# EAGLE design Nano (EAGLE 8.5.1)
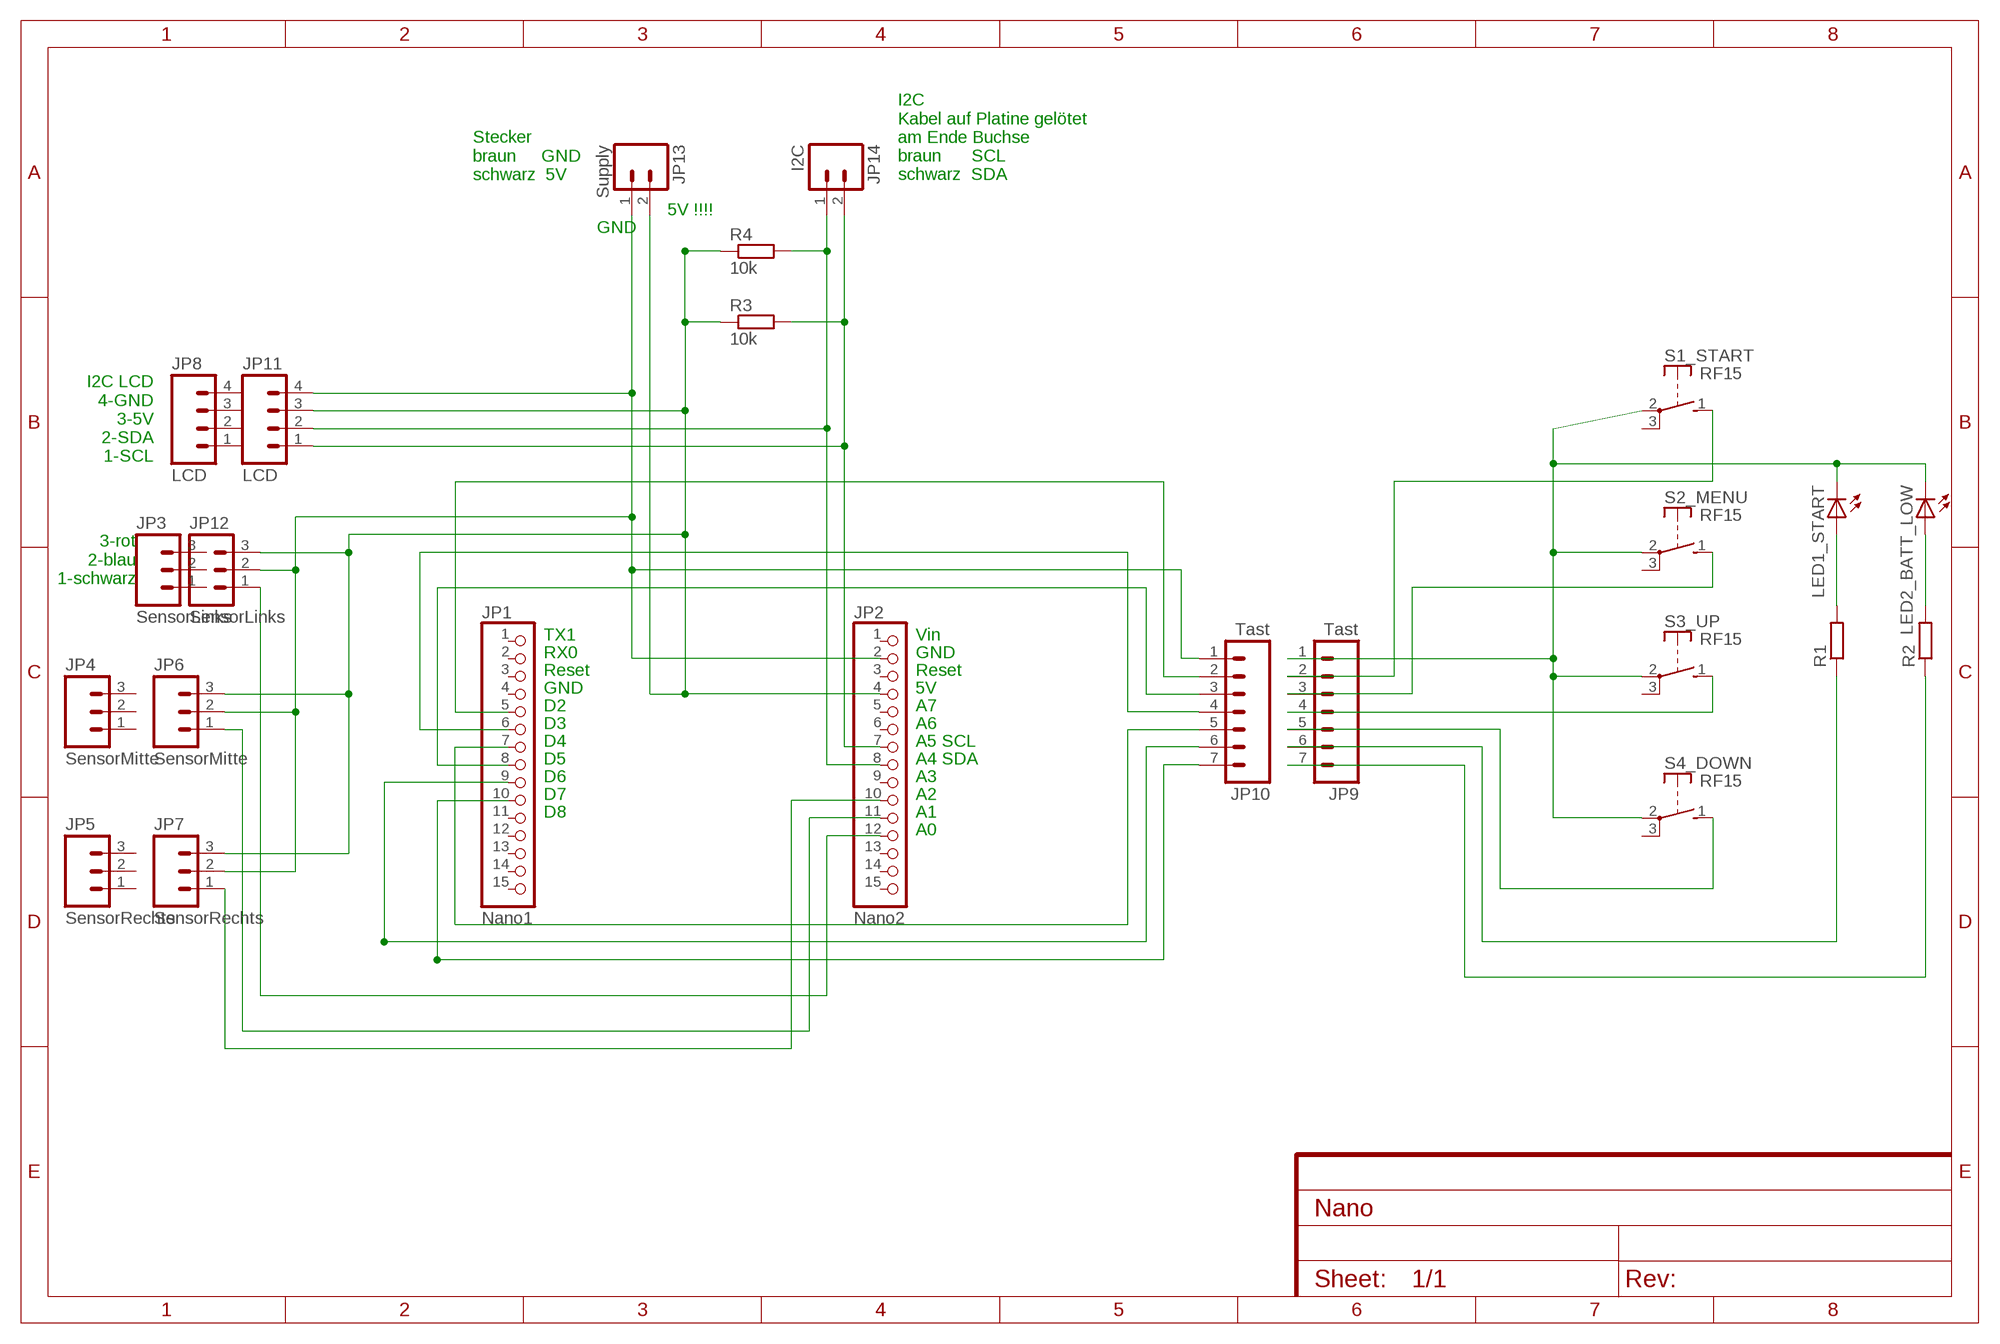
[diagram p0: schematic, sheet 1]

## Parts
JP1  Nano1  PINHD-1X15  [1X15]
JP2  Nano2  PINHD-1X15  [1X15]
JP3  SensorLinks  M03LOCK  [1X03_LOCK]
JP4  SensorMitte  M03LOCK  [1X03_LOCK]
JP5  SensorRechts  M03LOCK  [1X03_LOCK]
JP6  SensorMitte  M03LOCK  [1X03_LOCK]
JP7  SensorRechts  M03LOCK  [1X03_LOCK]
JP8  LCD  M04LOCK  [1X04_LOCK]
JP9  Tast  M07  [1X07]
JP10  Tast  M07  [1X07]
JP11  LCD  M04LOCK  [1X04_LOCK]
JP12  SensorLinks  M03LOCK  [1X03_LOCK]
JP13  Supply  M02LOCK  [1X02_LOCK]
JP14  I2C  M02LOCK  [1X02_LOCK]
LED1_START  LED_ELD260  [LED_LD260]
LED2_BATT_LOW  LED_ELD260  [LED_LD260]
R1  R-EU_0204/5  [0204/5]
R2  R-EU_0204/5  [0204/5]
R3  10k  R-EU_0204/5  [0204/5]
R4  10k  R-EU_0204/5  [0204/5]
S1_START  RF15  [RF15]
S2_MENU  RF15  [RF15]
S3_UP  RF15  [RF15]
S4_DOWN  RF15  [RF15]

## Nets
GND: JP9.1 LED1_START.K(C) LED2_BATT_LOW.K(C) S1_START.2(P) S2_MENU.2(P) S3_UP.2(P) S4_DOWN.2(P)
N$1: JP1.5 JP10.2
N$2: JP1.8 JP10.3
N$3: JP1.6 JP10.4
N$4: JP1.7 JP10.5
N$5: JP9.7 R2.1
N$7: LED2_BATT_LOW.A R2.2
N$8: LED1_START.A R1.2
N$9: JP1.9 JP10.6
N$11: JP2.12 JP12.1
N$12: JP2.11 JP6.1
N$13: JP2.10 JP7.1
N$21: JP2.4 JP6.3 JP7.3 JP11.3 JP12.3 JP13.2 R3.1 R4.1
N$22: JP2.2 JP6.2 JP7.2 JP10.1 JP11.4 JP12.2 JP13.1
N$23: JP2.7 JP11.1 JP14.2 R3.2
N$24: JP2.8 JP11.2 JP14.1 R4.2
N$26: JP9.2 S1_START.1(S)
N$27: JP9.4 S3_UP.1(S)
N$28: JP9.3 S2_MENU.1(S)
N$29: JP9.5 S4_DOWN.1(S)
N$30: JP9.6 R1.1
N$32: JP1.10 JP10.7
Unconnected: JP1.1 JP1.2 JP1.3 JP1.4 JP1.11 JP1.12 JP1.13 JP1.14 JP1.15 JP2.1 JP2.3 JP2.5 JP2.6 JP2.9 JP2.13 JP2.14 JP2.15 JP3.1 JP3.2 JP3.3 JP4.1 JP4.2 JP4.3 JP5.1 JP5.2 JP5.3 JP8.1 JP8.2 JP8.3 JP8.4 S1_START.3(P) S2_MENU.3(P) S3_UP.3(P) S4_DOWN.3(P)

## Notes on the sheet
- Stecker
  braun     GND
  schwarz  5V
- I2C
  Kabel auf Platine gelötet
  am Ende Buchse
  braun      SCL
  schwarz  SDA
- 5V !!!!
- GND
- I2C LCD
  4-GND
  3-5V
  2-SDA
  1-SCL
- 3-rot
  2-blau
  1-schwarz
- TX1 | Vin
- RX0 | GND
- Reset | Reset
- GND | 5V
- D2 | A7
- D3 | A6
- D4 | A5 SCL
- D5 | A4 SDA
- D6 | A3
- D7 | A2
- D8 | A1
- A0

## Library data of the parts
JP1 JP2 = adafruit:PINHD-1X15: PIN HEADER
JP3-JP7 JP12 = SparkFun-Connectors:M03: Header 3 Standard 3-pin 0.1" header. Use with straight break away headers (SKU : PRT-00116), right angle break away headers (PRT-00553), swiss pins (PRT-00743), machine pins (PRT-00117), and female headers (PRT-00115). Molex polarized connector foot print use with SKU : PRT-08232 with associated crimp pins and housings.
JP8 JP11 = SparkFun-Connectors:M04: Header 4 Standard 4-pin 0.1" header. Use with straight break away headers (SKU : PRT-00116), right angle break away headers (PRT-00553), swiss pins (PRT-00743), machine pins (PRT-00117), and female headers (PRT-00115). Molex polarized connector foot print use with SKU : PRT-08231 with associated crimp pins and housings. 1MM SMD Version SKU: PRT-10208
JP9 JP10 = SparkFun-Connectors:M07: Header 7 Standard 7-pin 0.1" header. Use with straight break away headers (SKU : PRT-00116), right angle break away headers (PRT-00553), swiss pins (PRT-00743), machine pins (PRT-00117), and female headers (PRT-00115). NOTES ON THE VARIANTS LOCK and LOCK_LONGPADS... This footprint was designed to help hold the alignment of a through-hole component (i.e. 7-pin header) while soldering it into place. You may notice that each hole has been shifted either up or down by 0.005 of an inch from it's more standard position (which is usually a perfectly straight line). This slight alteration caused the pins (the squares in the middle) to touch the edges of the holes. Because they are alternating, it causes a "brace" to hold the header in place. 0.005 has proven to be the perfect amount of "off-center" position when using our standard breakaway headers. Although looks a little odd when you look at the bare footprint, once you have a header in there, the alteration is very hard to notice. Also, if you push a header all the way into place, it is covered up entirely on the bottom side. This idea of altering the position of holes to aid alignment will be further integrated into the Sparkfun Library for other footprints. It can help hold any component with 3 or more connection pins.
JP13 JP14 = SparkFun-Connectors:M02: Standard 2-pin 0.1" header. Use with - straight break away headers ( PRT-00116) - right angle break away headers (PRT-00553) - swiss pins (PRT-00743) - machine pins (PRT-00117) - female headers (PRT-00115) Molex polarized connector foot print use with: PRT-08233 with associated crimp pins and housings. 2.54_SCREWTERM for use with PRT-10571. 3.5mm Screw Terminal footprints for PRT-08084 5mm Screw Terminal footprints for use with PRT-08432
LED1_START LED2_BATT_LOW = eagle-ltspice:LED_E: LED Source: http://www.osram.convergy.de Source: www.luxeon.com Source: www.kingbright.com; SPICEMODEL: NONE; SPICEPREFIX: D; SPICETYPE: diode
R1-R4 = rcl:R-EU_: RESISTOR, European symbol
S1_START S2_MENU S3_UP S4_DOWN = switch-misc:RF15: RAFI SWITCH

## Board
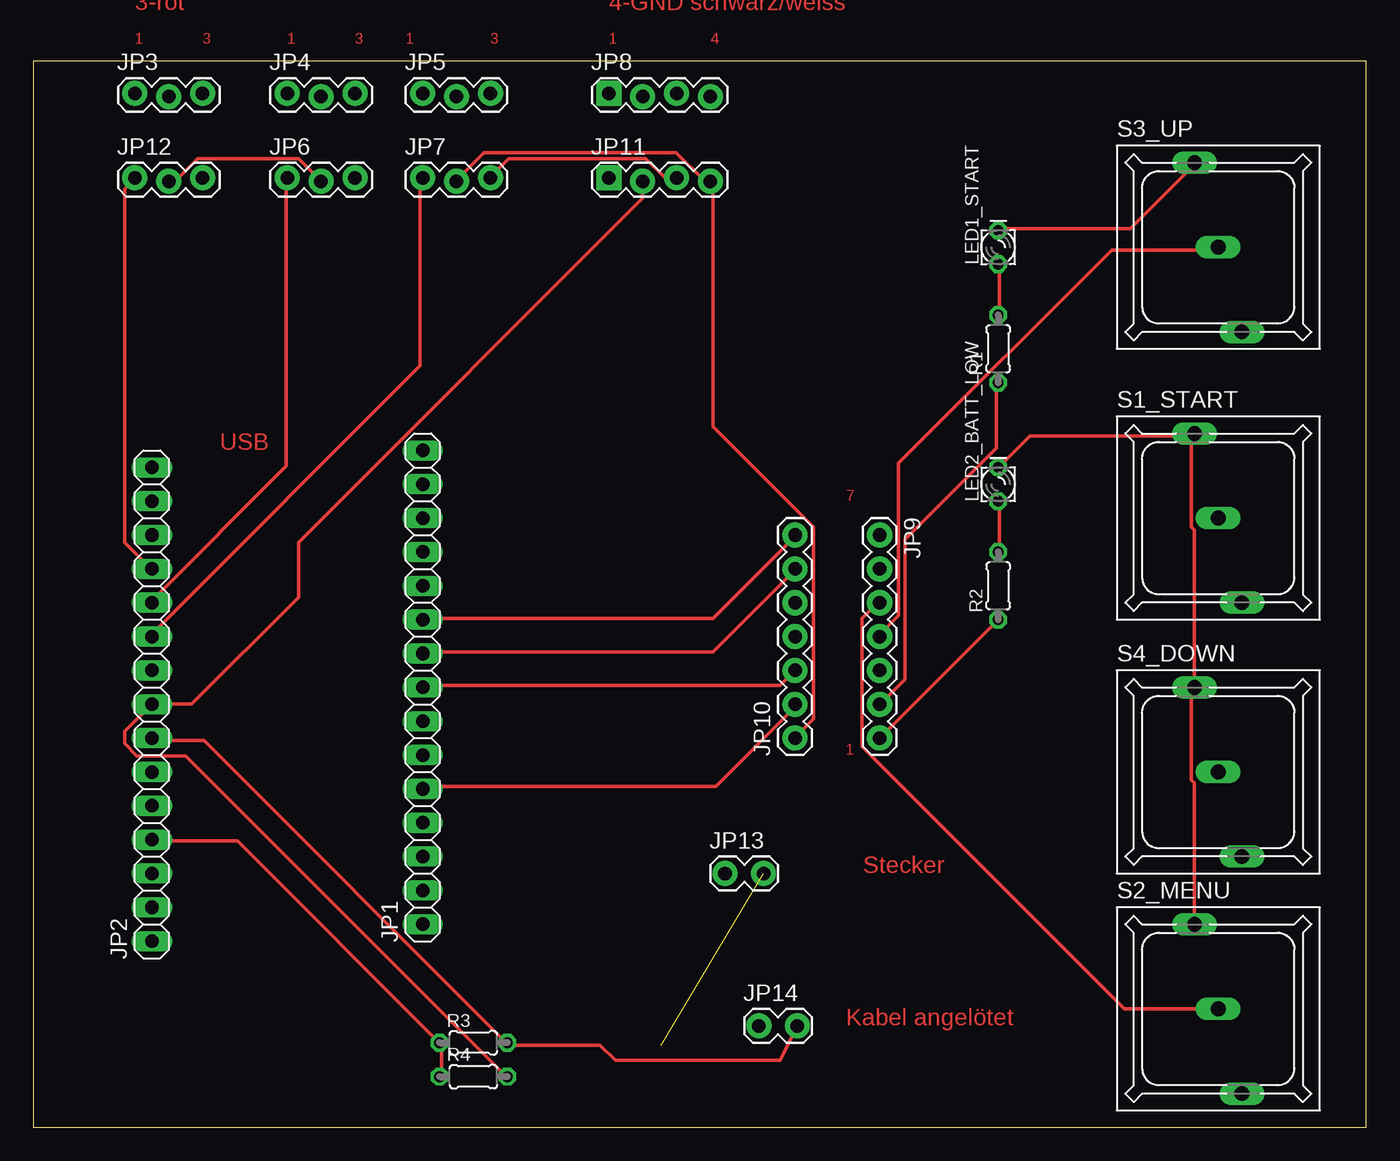
[diagram p1: board, top side]
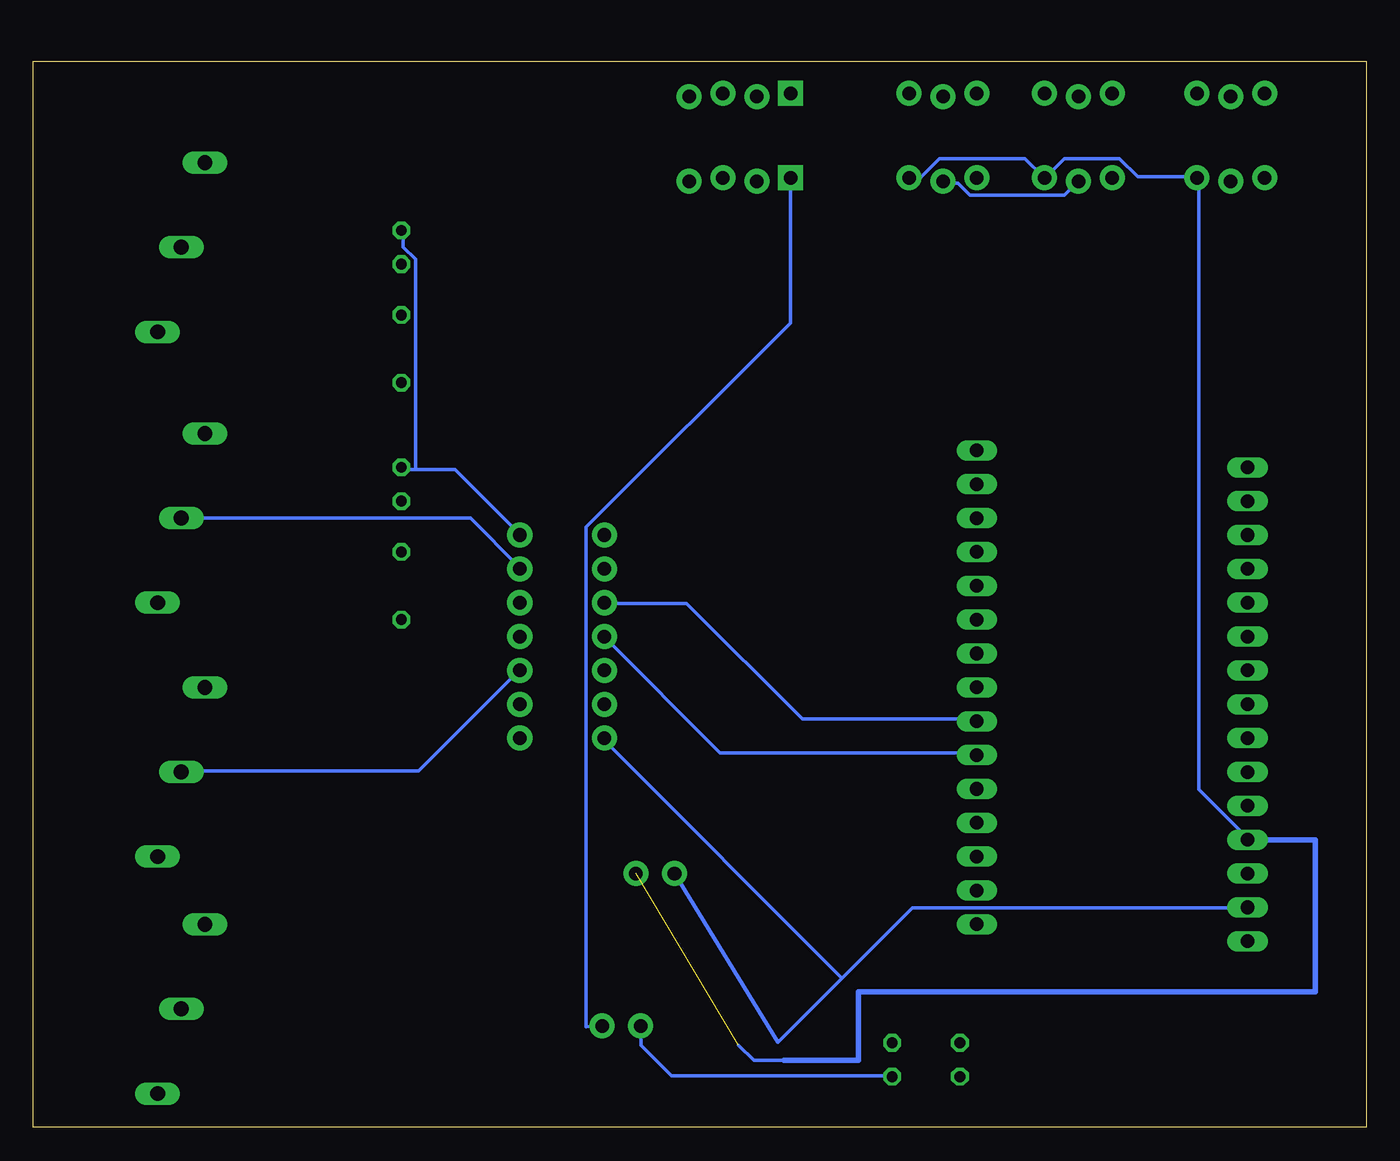
[diagram p2: board, bottom side, seen from below]

Size 100 x 80 mm. Coordinates in mm from the lower left corner, seen from the top.
Outline: 0,0 100,0 100,80 0,80 0,0
Copper layers (1*16): Top 0.035mm / dielectric 1.5mm / Bottom 0.035mm
Design rules "default": minimum track width 10mil, minimum drill 24mil, track to track 8mil, track to pad 8mil, pad to pad 8mil, via to via 8mil, smd to smd 8mil, copper to edge 40mil, drill to drill 8mil, minimum pad ring 10mil, minimum via ring 8mil, stop-mask expansion 4mil, vias tented up to drill 0mil, thermal gap 10mil

### Footprints (pad centres in the part's own frame; a part is rotated, then mirrored left to right if it is on the bottom)
1X15 = drill 1.016 long: 1 -17.78,0; 2 -15.24,0; 3 -12.7,0; 4 -10.16,0; 5 -7.62,0; 6 -5.08,0; 7 -2.54,0; 8 0,0; 9 2.54,0; 10 5.08,0; 11 7.62,0; 12 10.16,0; 13 12.7,0; 14 15.24,0; 15 17.78,0
1X03_LOCK = drill 1.016 pad 1.88: 1 0,0.127; 2 2.54,-0.127; 3 5.08,0.127
1X04_LOCK = drill 1.016 pad 1.88 square: 1 0,0.127 | drill 1.016 pad 1.88: 2 2.54,-0.127; 3 5.08,0.127; 4 7.62,-0.127
1X07 = drill 1.016 pad 1.88: 1 0,0; 2 2.54,0; 3 5.08,0; 4 7.62,0; 5 10.16,0; 6 12.7,0; 7 15.24,0
1X02_LOCK = drill 1.016 pad 1.88: 1 -0.178,0; 2 2.718,0
LED_LD260 = drill 0.813 octagon: A -1.27,0; K 1.27,0
0204/5 = drill 0.813 octagon: 1 -2.54,0; 2 2.54,0
RF15 = drill 1.118 long: 1 0,0; 2 -1.778,6.35; 3 1.778,-6.35

### Placement (x,y rotation side)
JP1  29.21,33.02 90 top
JP2  8.89,31.75 90 top
JP3  7.62,77.47 0 top
JP4  19.05,77.47 0 top
JP5  29.21,77.47 0 top
JP6  19.05,71.12 0 top
JP7  29.21,71.12 0 top
JP8  43.18,77.47 0 top
JP9  63.5,44.45 270 top
JP10  57.15,29.21 90 top
JP11  43.18,71.12 0 top
JP12  7.62,71.12 0 top
JP13  52.07,19.05 0 top
JP14  54.61,7.62 0 top
LED1_START  72.39,66.04 90 top
LED2_BATT_LOW  72.39,48.26 90 top
R1  72.39,58.42 90 top
R2  72.39,40.64 90 top
R3  33.02,6.35 0 top
R4  33.02,3.81 0 top
S1_START  88.9,45.72 0 top
S2_MENU  88.9,8.89 0 top
S3_UP  88.9,66.04 0 top
S4_DOWN  88.9,26.67 0 top

### Tracks (layer width: path | path; a pad name or v marks a point on that pad's centre or on a via)
GND
  Top 0.254: LED1_START.K 72.47,67.44 82.3,67.44 87.1,72.24 S3_UP.2 | S2_MENU.2 87.1,15.32 87.1,25.83 86.87,26.06 86.87,32.69 87.1,32.92 S4_DOWN.2 87.1,33.15 87.1,44.81 86.87,45.03 86.87,51.89 | 86.87,51.89 74.75,51.89 LED2_BATT_LOW.K | 86.87,51.89 87.1,51.89 S1_START.2 86.87,51.89
  Bottom 0.254: 71.32,49.38 68.35,49.38 63.55,44.58 JP9.1 | 71.32,49.38 72.24,49.38 LED2_BATT_LOW.K | 71.32,49.38 71.32,65.15 72.24,66.06 72.24,67.21 LED1_START.K
N$1
  Top 0.254: JP1.5 29.26,25.6 51.21,25.6 57.15,31.55 JP10.2
N$2
  Top 0.254: JP10.3 56.01,33.15 29.26,33.15 JP1.8
N$3
  Bottom 0.254: JP1.6 29.26,28.12 48.46,28.12 57.15,36.8 JP10.4
N$4
  Bottom 0.254: JP1.7 29.26,30.63 42.29,30.63 50.98,39.32 57.15,39.32 JP10.5
N$5
  Top 0.254: JP9.7 R2.1
N$7
  Top 0.254: R2.2 72.47,43.2 72.47,46.86 LED2_BATT_LOW.A
N$8
  Top 0.254: R1.2 72.47,61.04 72.47,64.69 LED1_START.A
N$9
  Top 0.254: JP1.9 29.26,35.66 50.98,35.66 57.15,41.83 JP10.6
N$11
  Top 0.254: JP2.12 8.69,42.06 6.86,43.89 6.86,70.41 7.54,71.09 JP12.1
N$12
  Top 0.254: JP2.11 8.91,39.55 18.97,49.61 18.97,71.09 JP6.1
N$13
  Top 0.254: JP2.10 8.91,37.03 29.03,57.15 29.03,71.09 JP7.1
N$21  (1 unrouted)
  Top 0.254: JP11.3 48.23,71.32 47.32,71.32 45.95,72.69 35.66,72.69 34.29,71.32 JP7.3 | R4.1 30.63,3.89 30.63,6.17 R3.1 30.4,6.4 15.32,21.49 8.91,21.49 JP2.4
  Bottom 0.254: 43.66,5.03 45.95,5.03 47.09,6.17 | JP7.3 34.29,71.32 33.38,71.32 32,72.69 25.6,72.69 24.23,71.32 JP6.3 24,71.32 22.63,72.69 18.52,72.69 17.14,71.32 12.8,71.32 JP12.3 12.57,71.09 12.57,25.38 8.91,21.72 JP2.4
  Bottom 0.406: 43.66,5.03 38.1,5.03 38.1,10.16 3.81,10.16 3.81,21.59 JP2.4
N$22
  Top 0.254: JP6.2 19.89,72.69 12.34,72.69 10.74,71.09 10.29,71.09 JP12.2 | JP7.2 31.77,71.09 33.83,73.15 48.23,73.15 50.29,71.09 50.75,71.09 JP11.4 50.98,70.87 50.98,52.58 58.52,45.03 58.52,30.63 57.15,29.26 JP10.1
  Bottom 0.254: JP6.2 22.63,69.95 29.72,69.95 30.63,70.87 31.55,70.87 JP7.2 | 39.32,11.2 44.12,6.4 JP13.1 | 39.32,11.2 34.06,16.46 8.91,16.46 JP2.2 | 39.32,11.2 57.15,29.03 JP10.1
N$23
  Top 0.254: JP14.2 56.01,5.03 43.66,5.03 42.52,6.17 35.66,6.17 R3.2 35.43,6.4 12.8,29.03 8.91,29.03 JP2.7
  Bottom 0.254: JP14.2 58.52,7.54 58.52,45.03 43.2,60.35 43.2,71.09 JP11.1
N$24
  Top 0.254: R4.2 35.43,3.89 11.43,27.89 7.77,27.89 6.86,28.8 6.86,29.72 JP2.8 8.91,31.77 11.89,31.77 19.89,39.78 19.89,43.89 45.72,69.72 JP11.2
  Bottom 0.254: R4.2 35.66,3.89 52.12,3.89 54.41,6.17 JP14.1
N$26
  Bottom 0.254: S1_START.1 67.21,45.72 63.55,42.06 JP9.2
N$27
  Top 0.254: S3_UP.1 88.7,65.84 80.92,65.84 64.92,49.84 64.92,38.41 63.55,37.03 JP9.4
N$28
  Top 0.254: S2_MENU.1 88.7,8.91 81.84,8.91 62.18,28.57 62.18,38.18 63.32,39.32 JP9.3
N$29
  Bottom 0.254: S4_DOWN.1 88.7,26.75 71.09,26.75 63.55,34.29 JP9.5
N$30
  Top 0.254: R1.1 72.24,55.78 72.24,50.98 65.38,44.12 65.38,33.6 63.55,31.77 JP9.6
N$32
  Top 0.254: JP1.10 29.26,38.18 50.98,38.18 57.15,44.35 JP10.7

### Text on the board
Top: 1-schwarz / 2-blau / 3-rot | 1-SCL gelb / 2-SDA gelb / 3-5V schwarz / 4-GND schwarz/weiss | 1 | 3 | 1 | 3 | 1 | 3 | 1 | 4 | USB | 7 | 1 | Stecker | Kabel angelötet